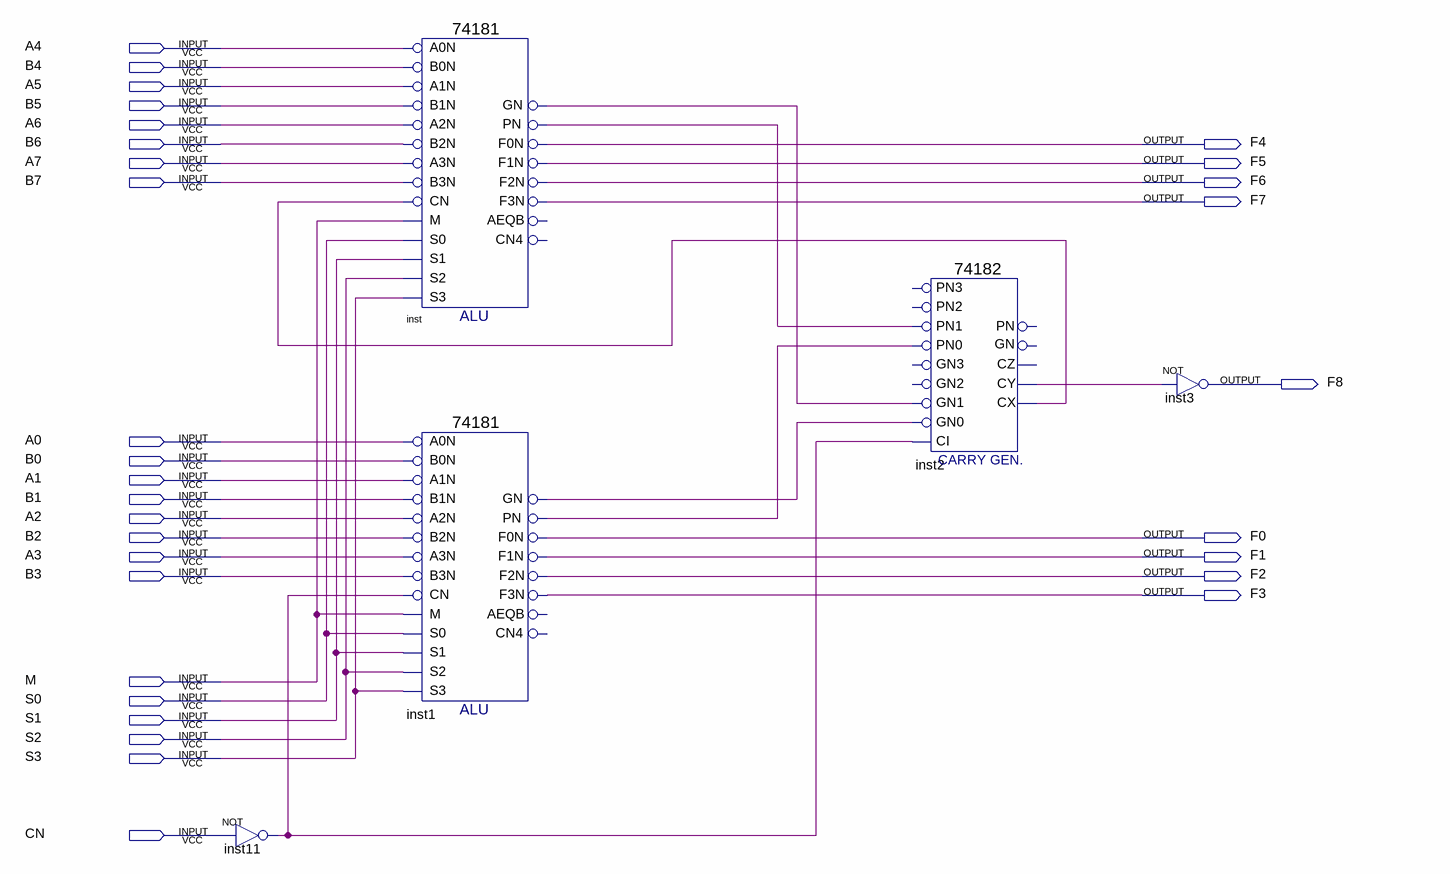
[diagram p0: schematic sheet]
// Quartus schematic ALU8_with_set_model.bdf as structural Verilog: 5 symbols, 31 pins
module ALU8_with_set_model (
  input  A4,
  input  B4,
  input  A5,
  input  B5,
  input  A6,
  input  B6,
  input  A7,
  input  B7,
  input  A0,
  input  B0,
  input  A1,
  input  B1,
  input  A2,
  input  B2,
  input  A3,
  input  B3,
  input  M,
  input  S0,
  input  S1,
  input  S2,
  input  S3,
  input  CN,
  output F4,
  output F5,
  output F6,
  output F7,
  output F8,
  output F0,
  output F1,
  output F2,
  output F3
);

  wire inst1_gn, inst1_pn, inst2_cx, inst2_cy, inst11_out, inst_gn, inst_pn;

  not inst11 (inst11_out, CN);
  \74181  inst (
    .B0N(B4), .A0N(A4), .A1N(A5), .B1N(B5), .A3N(A7), .B2N(B6), .A2N(A6), .M(M), .CN(inst2_cx), .B3N(B7),
    .S2(S2), .S1(S1), .S0(S0), .S3(S3), .PN(inst_pn), .GN(inst_gn), .F3N(F7), .F1N(F5), .F0N(F4), .F2N(F6));  // open: AEQB, CN4
  \74181  inst1 (
    .B0N(B0), .A0N(A0), .A1N(A1), .B1N(B1), .A3N(A3), .B2N(B2), .A2N(A2), .M(M), .CN(inst11_out), .B3N(B3),
    .S2(S2), .S1(S1), .S0(S0), .S3(S3), .PN(inst1_pn), .GN(inst1_gn), .F3N(F3), .F1N(F1), .F0N(F0), .F2N(F2));  // open: AEQB, CN4
  \74182  inst2 (
    .CI(inst11_out), .PN1(inst_pn), .PN0(inst1_pn), .GN1(inst_gn), .GN0(inst1_gn), .CY(inst2_cy),
    .CX(inst2_cx));  // open: PN2, GN2, GN3, PN3, PN, CZ, GN
  not inst3 (F8, inst2_cy);
endmodule
